# Altium schematic sheet Microcontroller.SchDoc
size A; SheetNumber: 2; SheetTotal: 4
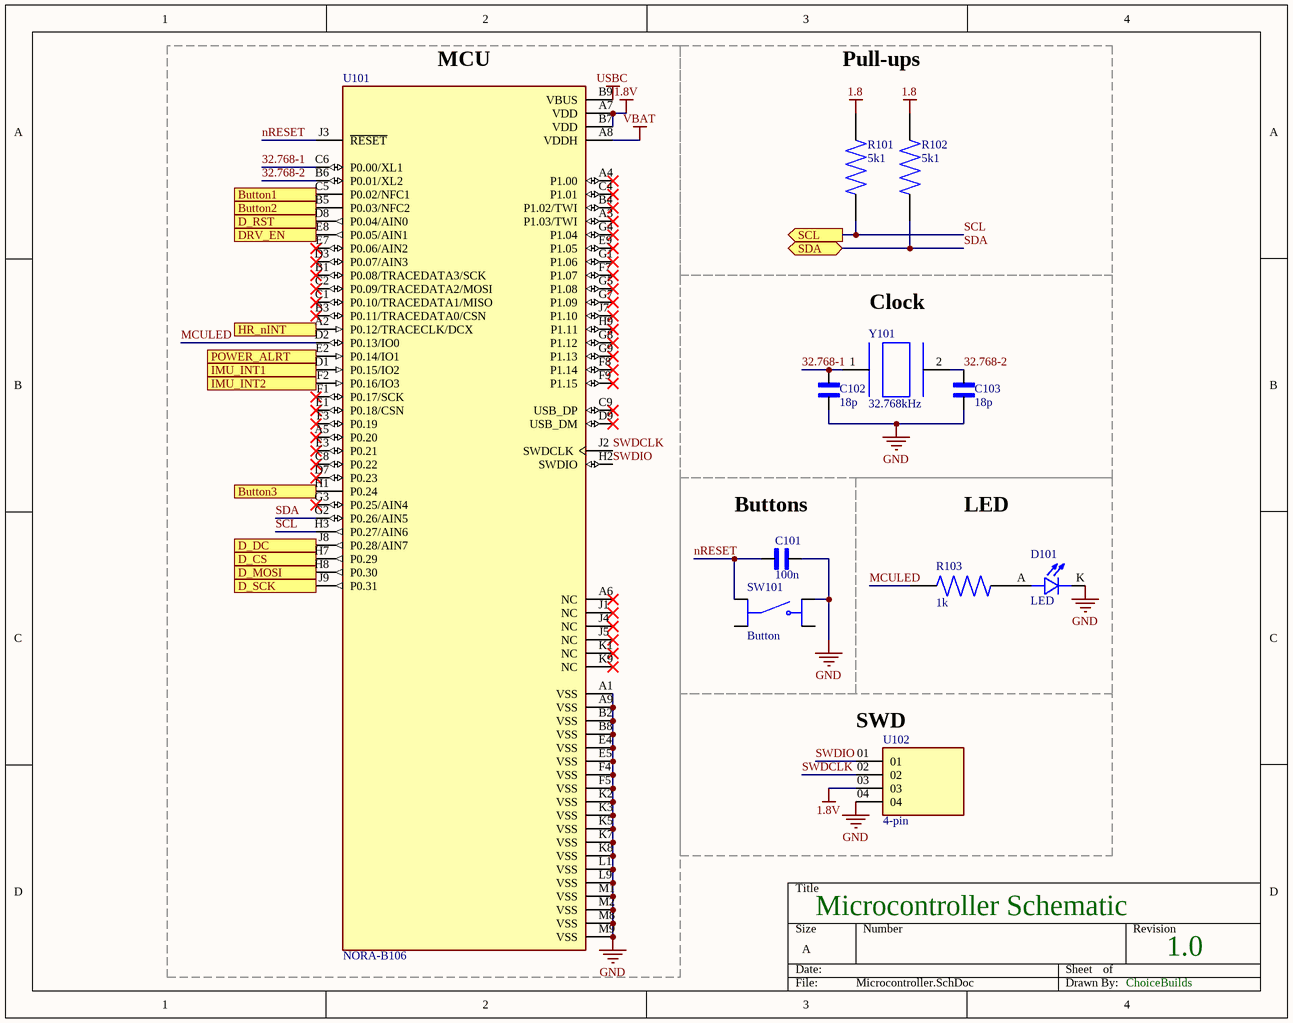
[diagram p0: Microcontroller.SchDoc]

## Parts
C101  100n  [0402c]
C102  18p  [0402c]
C103  18p  [0402c]
D101  LED  [.LED]
R101  5k1  [0402r]
R102  5k1  [0402r]
R103  1k  [0402r]
SW101  Button  [.Button]
U101  NORA-B106  [NORA-B106]
U102  4-pin  [4-pin]
Y101  32.768kHz  [32.768kHz]

## Blocks framed on the sheet
MCU: U101
Pull-ups: R101 R102
Clock: C102 C103 Y101
Buttons: C101 SW101
LED: D101 R103
SWD: U102

## Ports
Button1 (in), Button2 (in), Button3 (in), D_CS (out), D_DC (out), D_MOSI (out), D_RST (out), D_SCK (out), DRV_EN (out), HR_nINT (in), IMU_INT1 (in), IMU_INT2 (in), POWER_ALRT (in), SCL (out), SDA (bidir)

## Nets
1.8: R101.2 R102.2
1.8V: U101.A7(VDD) U101.B7(VDD) U102.03
GND: C101.2 C102.1 C103.1 D101.K SW101.B1 U101.A1(VSS) U101.A9(VSS) U101.B2(VSS) U101.B8(VSS) U101.E4(VSS) U101.E5(VSS) U101.F4(VSS) U101.F5(VSS) U101.K2(VSS) U101.K3(VSS) U101.K5(VSS) U101.K7(VSS) U101.K8(VSS) U101.L1(VSS) U101.L9(VSS) U101.M1(VSS) U101.M2(VSS) U101.M8(VSS) U101.M9(VSS) U102.04
USBC: U101.B9(VBUS)
VBAT: U101.A8(VDDH)
32.768-1: C102.2 U101.C6(P0.00/XL1) Y101.1
32.768-2: C103.2 U101.B6(P0.01/XL2) Y101.2
Button1: U101.C5(P0.02/NFC1) ; port Button1
Button2: U101.B5(P0.03/NFC2) ; port Button2
Button3: U101.H1(P0.24) ; port Button3
D_CS: U101.H7(P0.29) ; port D_CS
D_DC: U101.J8(P0.28/AIN7) ; port D_DC
D_MOSI: U101.H8(P0.30) ; port D_MOSI
D_RST: U101.D8(P0.04/AIN0) ; port D_RST
D_SCK: U101.J9(P0.31) ; port D_SCK
DRV_EN: U101.E8(P0.05/AIN1) ; port DRV_EN
HR_nINT: U101.A2(P0.12/TRACECLK/DCX) ; port HR_nINT
IMU_INT1: U101.D1(P0.15/IO2) ; port IMU_INT1
IMU_INT2: U101.F2(P0.16/IO3) ; port IMU_INT2
MCULED: R103.1 U101.D2(P0.13/IO0)
nRESET: C101.1 SW101.A1 U101.J3(~{RESET})
POWER_ALRT: U101.E2(P0.14/IO1) ; port POWER_ALRT
SCL: R101.1 U101.H3(P0.27/AIN6) ; port SCL
SDA: R102.1 U101.G2(P0.26/AIN5) ; port SDA
SWDCLK: U101.J2(SWDCLK) U102.02
SWDIO: U101.H2(SWDIO) U102.01
NetD101_A: D101.A R103.2

Not connected (* = marked no-connect by the designer): SW101 A2 B2; U101 A3(P1.03/TWI)* A4(P1.00)* A5(P0.20)* A6(NC)* B1(P0.08/TRACEDATA3/SCK)* B3(P0.11/TRACEDATA0/CSN)* B4(P1.02/TWI)* C1(P0.10/TRACEDATA1/MISO)* C2(P0.09/TRACEDATA2/MOSI)* C4(P1.01)* C8(P0.22)* C9(USB_DP)* D3(P0.07/AIN3)* D7(P0.23)* D9(USB_DM)* E1(P0.18/CSN)* E3(P0.21)* E7(P0.06/AIN2)* E9(P1.05)* F1(P0.17/SCK)* F3(P0.19)* F7(P1.07)* F8(P1.14)* F9(P1.15)* G1(P1.06)* G3(P0.25/AIN4)* G4(P1.04)* G5(P1.08)* G7(P1.09)* G8(P1.12)* G9(P1.13)* H9(P1.11)* J1(NC)* J4(NC)* J5(NC)* J7(P1.10)* K1(NC)* K9(NC)*

## Notes on the sheet
- Microcontroller Schematic
- 1.0
- ChoiceBuilds

## Library data of the parts
C101-C103 = 0402c
D101 = .LED
R101-R103 = 0402r
SW101 = .Button